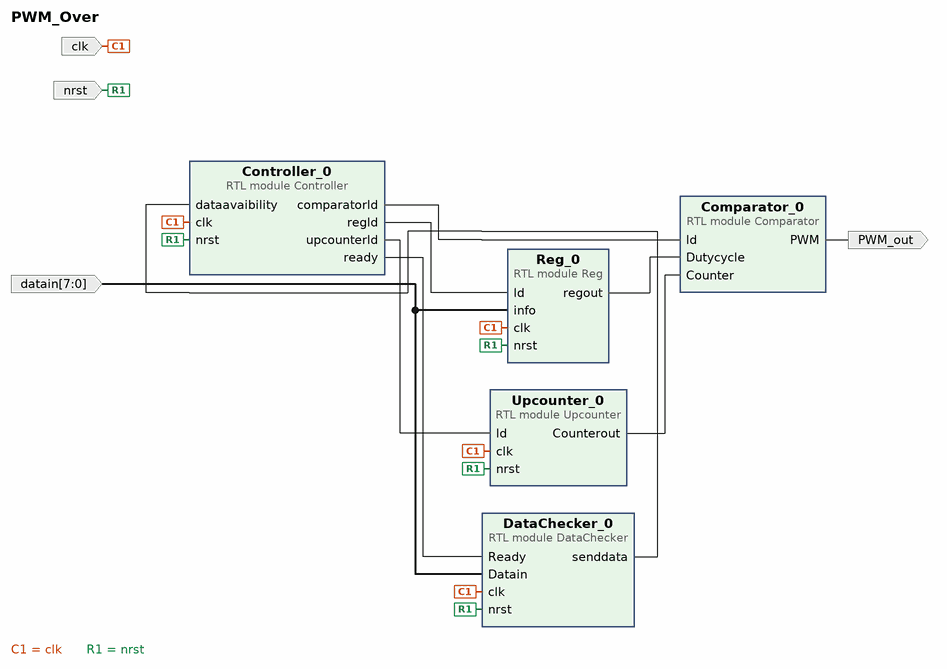
[diagram p0: block diagram of the top level]
# Vivado block design PWM_Over, xc7z020clg400-1, Vivado 2023.1
create_bd_design PWM_Over

create_bd_port -dir O PWM_out
create_bd_port -dir I -from 7 -to 0 datain
create_bd_port -dir I clk
create_bd_port -dir I nrst

create_bd_cell -type module -reference Upcounter Upcounter_0
create_bd_cell -type module -reference Reg Reg_0
create_bd_cell -type module -reference DataChecker DataChecker_0
create_bd_cell -type module -reference Comparator Comparator_0
create_bd_cell -type module -reference Controller Controller_0

# ---- connections ----

connect_bd_net [get_bd_pins Comparator_0/PWM] [get_bd_ports PWM_out]
connect_bd_net [get_bd_pins Controller_0/comparatorld] [get_bd_pins Comparator_0/ld]
connect_bd_net [get_bd_pins Controller_0/ready] [get_bd_pins DataChecker_0/Ready]
connect_bd_net [get_bd_pins Controller_0/regld] [get_bd_pins Reg_0/ld]
connect_bd_net [get_bd_pins Controller_0/upcounterld] [get_bd_pins Upcounter_0/ld]
connect_bd_net [get_bd_pins DataChecker_0/senddata] [get_bd_pins Controller_0/dataavaibility]
connect_bd_net [get_bd_ports clk] [get_bd_pins Upcounter_0/clk] [get_bd_pins Reg_0/clk] [get_bd_pins DataChecker_0/clk] [get_bd_pins Controller_0/clk]
connect_bd_net [get_bd_ports nrst] \
  [get_bd_pins Upcounter_0/nrst] [get_bd_pins Reg_0/nrst] [get_bd_pins DataChecker_0/nrst] [get_bd_pins Controller_0/nrst]
connect_bd_net [get_bd_pins Reg_0/regout] [get_bd_pins Comparator_0/Dutycycle]
connect_bd_net [get_bd_pins Upcounter_0/Counterout] [get_bd_pins Comparator_0/Counter]
connect_bd_net [get_bd_ports datain] [get_bd_pins Reg_0/info] [get_bd_pins DataChecker_0/Datain]

validate_bd_design
save_bd_design
